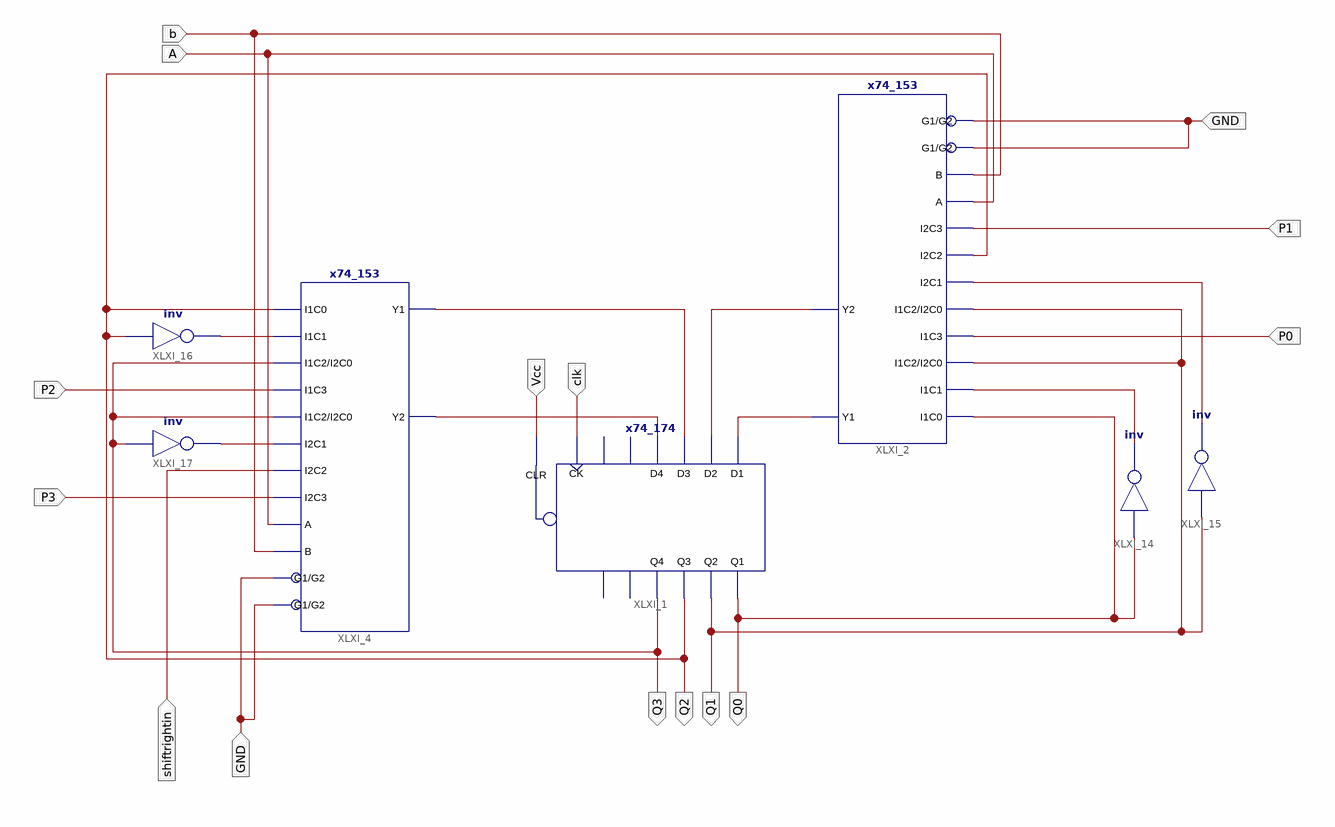
[diagram p0: schematic sheet 1]
// Xilinx ISE schematic lab10_1.sch (xa9500xl) as structural Verilog: 7 symbols, 14 ports
module lab10_1 (
  input  P1,
  input  P0,
  input  P2,
  input  P3,
  input  GND,
  input  clk,
  input  Vcc,
  input  b,
  input  A,
  input  shiftrightin,
  output Q0,
  output Q1,
  output Q2,
  output Q3
);

  wire XLXN_12, XLXN_13, XLXN_15, XLXN_16, XLXN_26, XLXN_30, XLXN_32, XLXN_34;

  x74_174 XLXI_1 (
    .CK(clk), .CLR(Vcc), .D1(XLXN_12), .D2(XLXN_13), .D3(XLXN_15), .D4(XLXN_16), .Q1(Q0), .Q2(Q1), .Q3(Q2),
    .Q4(Q3));  // open: D5, D6, Q5, Q6
  not XLXI_14 (XLXN_32, Q0);
  not XLXI_15 (XLXN_34, Q1);
  not XLXI_16 (XLXN_26, Q2);
  not XLXI_17 (XLXN_30, Q3);
  x74_153 XLXI_2 (
    .A(A), .B(b), .G1(GND), .G2(GND), .I1C0(Q0), .I1C1(XLXN_32), .I1C2(Q1), .I1C3(P0), .I2C0(Q1),
    .I2C1(XLXN_34), .I2C2(Q2), .I2C3(P1), .Y1(XLXN_12), .Y2(XLXN_13));
  x74_153 XLXI_4 (
    .A(A), .B(b), .G1(GND), .G2(GND), .I1C0(Q2), .I1C1(XLXN_26), .I1C2(Q3), .I1C3(P2), .I2C0(Q3),
    .I2C1(XLXN_30), .I2C2(shiftrightin), .I2C3(P3), .Y1(XLXN_15), .Y2(XLXN_16));
endmodule
